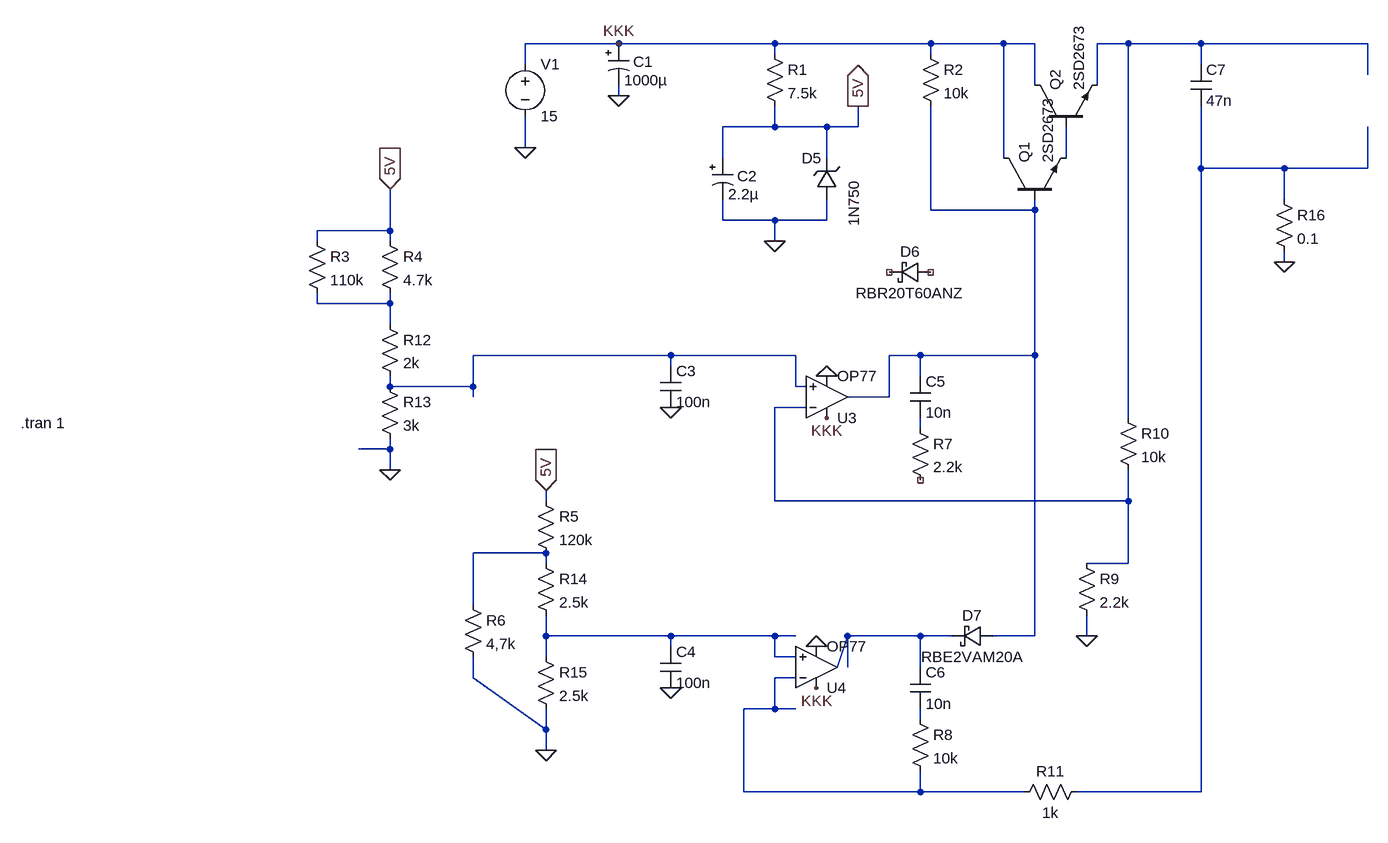
[diagram p0: schematic Projekt.asc]
Projekt.asc, the LTspice schematic file:
Version 4
SHEET 1 1560 1344
WIRE 320 144 176 144
WIRE 560 144 320 144
WIRE 800 144 560 144
WIRE 912 144 800 144
WIRE 960 144 912 144
WIRE 1104 144 1056 144
WIRE 1216 144 1104 144
WIRE 1472 144 1216 144
WIRE 560 160 560 144
WIRE 800 160 800 144
WIRE 176 176 176 144
WIRE 1216 176 1216 144
WIRE 1472 192 1472 144
WIRE 960 208 960 144
WIRE 1056 208 1056 144
WIRE 320 224 320 208
WIRE 560 272 560 240
WIRE 560 272 480 272
WIRE 640 272 560 272
WIRE 688 272 688 240
WIRE 688 272 640 272
WIRE 176 304 176 256
WIRE 480 320 480 272
WIRE 640 320 640 272
WIRE 912 320 912 144
WIRE 1008 320 1008 272
WIRE 1216 336 1216 240
WIRE 1344 336 1216 336
WIRE 1472 336 1472 272
WIRE 1472 336 1344 336
WIRE 1344 384 1344 336
WIRE 800 400 800 240
WIRE 960 400 960 384
WIRE 960 400 800 400
WIRE 480 416 480 384
WIRE 560 416 480 416
WIRE 640 416 640 384
WIRE 640 416 560 416
WIRE -32 432 -32 368
WIRE -32 432 -144 432
WIRE -144 448 -144 432
WIRE -32 448 -32 432
WIRE 560 448 560 416
WIRE 1344 480 1344 464
WIRE -144 544 -144 528
WIRE -32 544 -32 528
WIRE -32 544 -144 544
WIRE -32 576 -32 544
WIRE 400 624 96 624
WIRE 592 624 400 624
WIRE 784 624 736 624
WIRE 960 624 960 400
WIRE 960 624 784 624
WIRE 400 640 400 624
WIRE 784 656 784 624
WIRE -32 672 -32 656
WIRE 96 672 96 624
WIRE 96 672 -32 672
WIRE 592 672 592 624
WIRE 608 672 592 672
WIRE 96 688 96 672
WIRE 736 688 736 624
WIRE 736 688 672 688
WIRE 608 704 560 704
WIRE 1104 720 1104 144
WIRE 784 736 784 720
WIRE -32 768 -32 752
WIRE -32 768 -80 768
WIRE -32 800 -32 768
WIRE 208 848 208 832
WIRE 560 848 560 704
WIRE 1104 848 1104 800
WIRE 1104 848 560 848
WIRE 208 928 96 928
WIRE 208 944 208 928
WIRE 1104 944 1104 848
WIRE 1104 944 1040 944
WIRE 96 1008 96 928
WIRE 208 1056 208 1024
WIRE 400 1056 208 1056
WIRE 560 1056 400 1056
WIRE 592 1056 560 1056
WIRE 784 1056 672 1056
WIRE 832 1056 784 1056
WIRE 960 1056 960 624
WIRE 960 1056 896 1056
WIRE 1040 1056 1040 1024
WIRE 400 1072 400 1056
WIRE 208 1088 208 1056
WIRE 560 1088 560 1056
WIRE 592 1088 560 1088
WIRE 656 1104 672 1056
WIRE 672 1104 672 1056
WIRE 784 1104 784 1056
WIRE 96 1120 96 1088
WIRE 592 1120 560 1120
WIRE 560 1168 560 1120
WIRE 560 1168 512 1168
WIRE 592 1168 560 1168
WIRE 784 1184 784 1168
WIRE 208 1200 96 1120
WIRE 208 1200 208 1168
WIRE 208 1232 208 1200
WIRE 512 1296 512 1168
WIRE 784 1296 784 1264
WIRE 784 1296 512 1296
WIRE 944 1296 784 1296
WIRE 1216 1296 1216 336
WIRE 1216 1296 1024 1296
FLAG 320 224 0
FLAG 560 448 0
FLAG 688 240 5V
IOPIN 688 240 Out
FLAG -32 368 5V
IOPIN -32 368 In
FLAG 400 704 0
FLAG 208 832 5V
IOPIN 208 832 In
FLAG -32 800 0
FLAG 208 1232 0
FLAG 400 1136 0
FLAG 1040 1056 0
FLAG 1344 480 0
FLAG 320 144 KKK
FLAG 640 720 KKK
FLAG 624 1136 KKK
FLAG 176 304 0
FLAG 640 656 0
FLAG 624 1072 0
DATAFLAG 960 1056 ""
DATAFLAG 960 624 ""
DATAFLAG 928 1056 ""
DATAFLAG 240 624 ""
DATAFLAG 1408 144 ""
SYMBOL polcap 304 144 R0
WINDOW 0 38 28 Left 2
WINDOW 3 24 56 Left 2
SYMATTR InstName C1
SYMATTR Value 1000µ
SYMATTR Description Capacitor
SYMATTR Type cap
SYMATTR SpiceLine V=25 Irms=2.88 Rser=0.0117 Lser=9.49n
SYMBOL res 544 144 R0
SYMATTR InstName R1
SYMATTR Value 7.5k
SYMBOL zener 656 384 R180
WINDOW 0 24 64 Left 2
WINDOW 3 -26 -41 VRight 2
SYMATTR InstName D5
SYMATTR Value 1N750
SYMATTR Description Diode
SYMATTR Type diode
SYMBOL res 784 144 R0
SYMATTR InstName R2
SYMATTR Value 10k
SYMBOL res -160 432 R0
SYMATTR InstName R3
SYMATTR Value 110k
SYMBOL res -48 432 R0
SYMATTR InstName R4
SYMATTR Value 4.7k
SYMBOL polcap 464 320 R0
WINDOW 0 38 28 Left 2
WINDOW 3 24 56 Left 2
SYMATTR InstName C2
SYMATTR Value 2.2µ
SYMATTR Description Capacitor
SYMATTR Type cap
SYMATTR SpiceLine V=25 Irms=2.88 Rser=0.0117 Lser=9.49n
SYMBOL cap 384 640 R0
SYMATTR InstName C3
SYMATTR Value 100n
SYMBOL npn 912 384 R270
SYMATTR InstName Q1
SYMATTR Value 2SD2673
SYMBOL npn 960 272 R270
SYMATTR InstName Q2
SYMATTR Value 2SD2673
SYMBOL schottky 800 480 R90
WINDOW 0 0 32 VBottom 2
WINDOW 3 32 32 VTop 2
SYMATTR InstName D6
SYMATTR Value RBR20T60ANZ
SYMBOL res 192 832 R0
SYMATTR InstName R5
SYMATTR Value 120k
SYMBOL res 80 992 R0
SYMATTR InstName R6
SYMATTR Value 4,7k
SYMBOL cap 384 1072 R0
SYMATTR InstName C4
SYMATTR Value 100n
SYMBOL schottky 896 1040 R90
WINDOW 0 0 32 VBottom 2
WINDOW 3 32 32 VTop 2
SYMATTR InstName D7
SYMATTR Value RBE2VAM20A
SYMBOL cap 768 656 R0
SYMATTR InstName C5
SYMATTR Value 10n
SYMBOL res 768 720 R0
SYMATTR InstName R7
SYMATTR Value 2.2k
SYMBOL cap 768 1104 R0
SYMATTR InstName C6
SYMATTR Value 10n
SYMBOL res 768 1168 R0
SYMATTR InstName R8
SYMATTR Value 10k
SYMBOL res 1024 928 R0
SYMATTR InstName R9
SYMATTR Value 2.2k
SYMBOL res 1040 1280 R90
WINDOW 0 0 56 VBottom 2
WINDOW 3 32 56 VTop 2
SYMATTR InstName R11
SYMATTR Value 1k
SYMBOL res 1088 704 R0
SYMATTR InstName R10
SYMATTR Value 10k
SYMBOL cap 1200 176 R0
SYMATTR InstName C7
SYMATTR Value 47n
SYMBOL OpAmps\\OP77 640 752 M180
SYMATTR InstName U3
SYMBOL OpAmps\\OP77 624 1168 M180
SYMATTR InstName U4
SYMBOL res -48 560 R0
SYMATTR InstName R12
SYMATTR Value 2k
SYMBOL res -48 656 R0
SYMATTR InstName R13
SYMATTR Value 3k
SYMBOL res 192 928 R0
SYMATTR InstName R14
SYMATTR Value 2.5k
SYMBOL res 192 1072 R0
SYMATTR InstName R15
SYMATTR Value 2.5k
SYMBOL voltage 176 160 R0
WINDOW 123 0 0 Left 0
WINDOW 39 0 0 Left 0
SYMATTR InstName V1
SYMATTR Value 15
SYMBOL res 1328 368 R0
SYMATTR InstName R16
SYMATTR Value 0.1
TEXT -600 728 Left 2 !.tran 1

The netlist it stands for:
* Projekt.asc
C1 KKK 0 1000µ V=25 Irms=2.88 Rser=0.0117 Lser=9.49n
R1 KKK 5V 7.5k
D5 0 5V 1N750
R2 KKK N004 10k
R3 5V N005 110k
R4 5V N005 4.7k
C2 5V 0 2.2µ V=25 Irms=2.88 Rser=0.0117 Lser=9.49n
C3 N006 0 100n
Q1 KKK N004 N002 0 2SD2673
Q2 KKK N002 N001 0 2SD2673
D6 NC_01 NC_02 RBR20T60ANZ
R5 5V N009 120k
R6 N009 0 4,7k
C4 N010 0 100n
D7 N004 N011 RBE2VAM20A
C5 N004 N008 10n
R7 N008 NC_03 2.2k
C6 N011 N013 10n
R8 N013 N012 10k
R9 N007 0 2.2k
R11 N003 N012 1k
R10 N001 N007 10k
C7 N001 N003 47n
XU3 N006 N007 KKK 0 N004 OP77  ; pins In+ In- V+ V- OUT
XU4 N010 N012 KKK 0 N011 OP77  ; pins In+ In- V+ V- OUT
R12 N005 N006 2k
R13 N006 0 3k
R14 N009 N010 2.5k
R15 N010 0 2.5k
V1 KKK 0 15
R16 N003 0 0.1
.model D D
.lib standard.dio
.model NPN NPN
.model PNP PNP
.lib standard.bjt
.tran 1
.lib ADI.lib
.backanno
.end